# EasyEDA Pro project Timer_PCB_Project.eprj

# Schematic Schematic1
Board Name: Board1; Create Date: 2025-04-19; Page Name: Timer Schematic; Project Name: Timer_PCB_Project; Schematic Name: Schematic1; Update Date: 2025-04-19; Company: EasyEDA.com; Page Size: A4; Version: V1.0
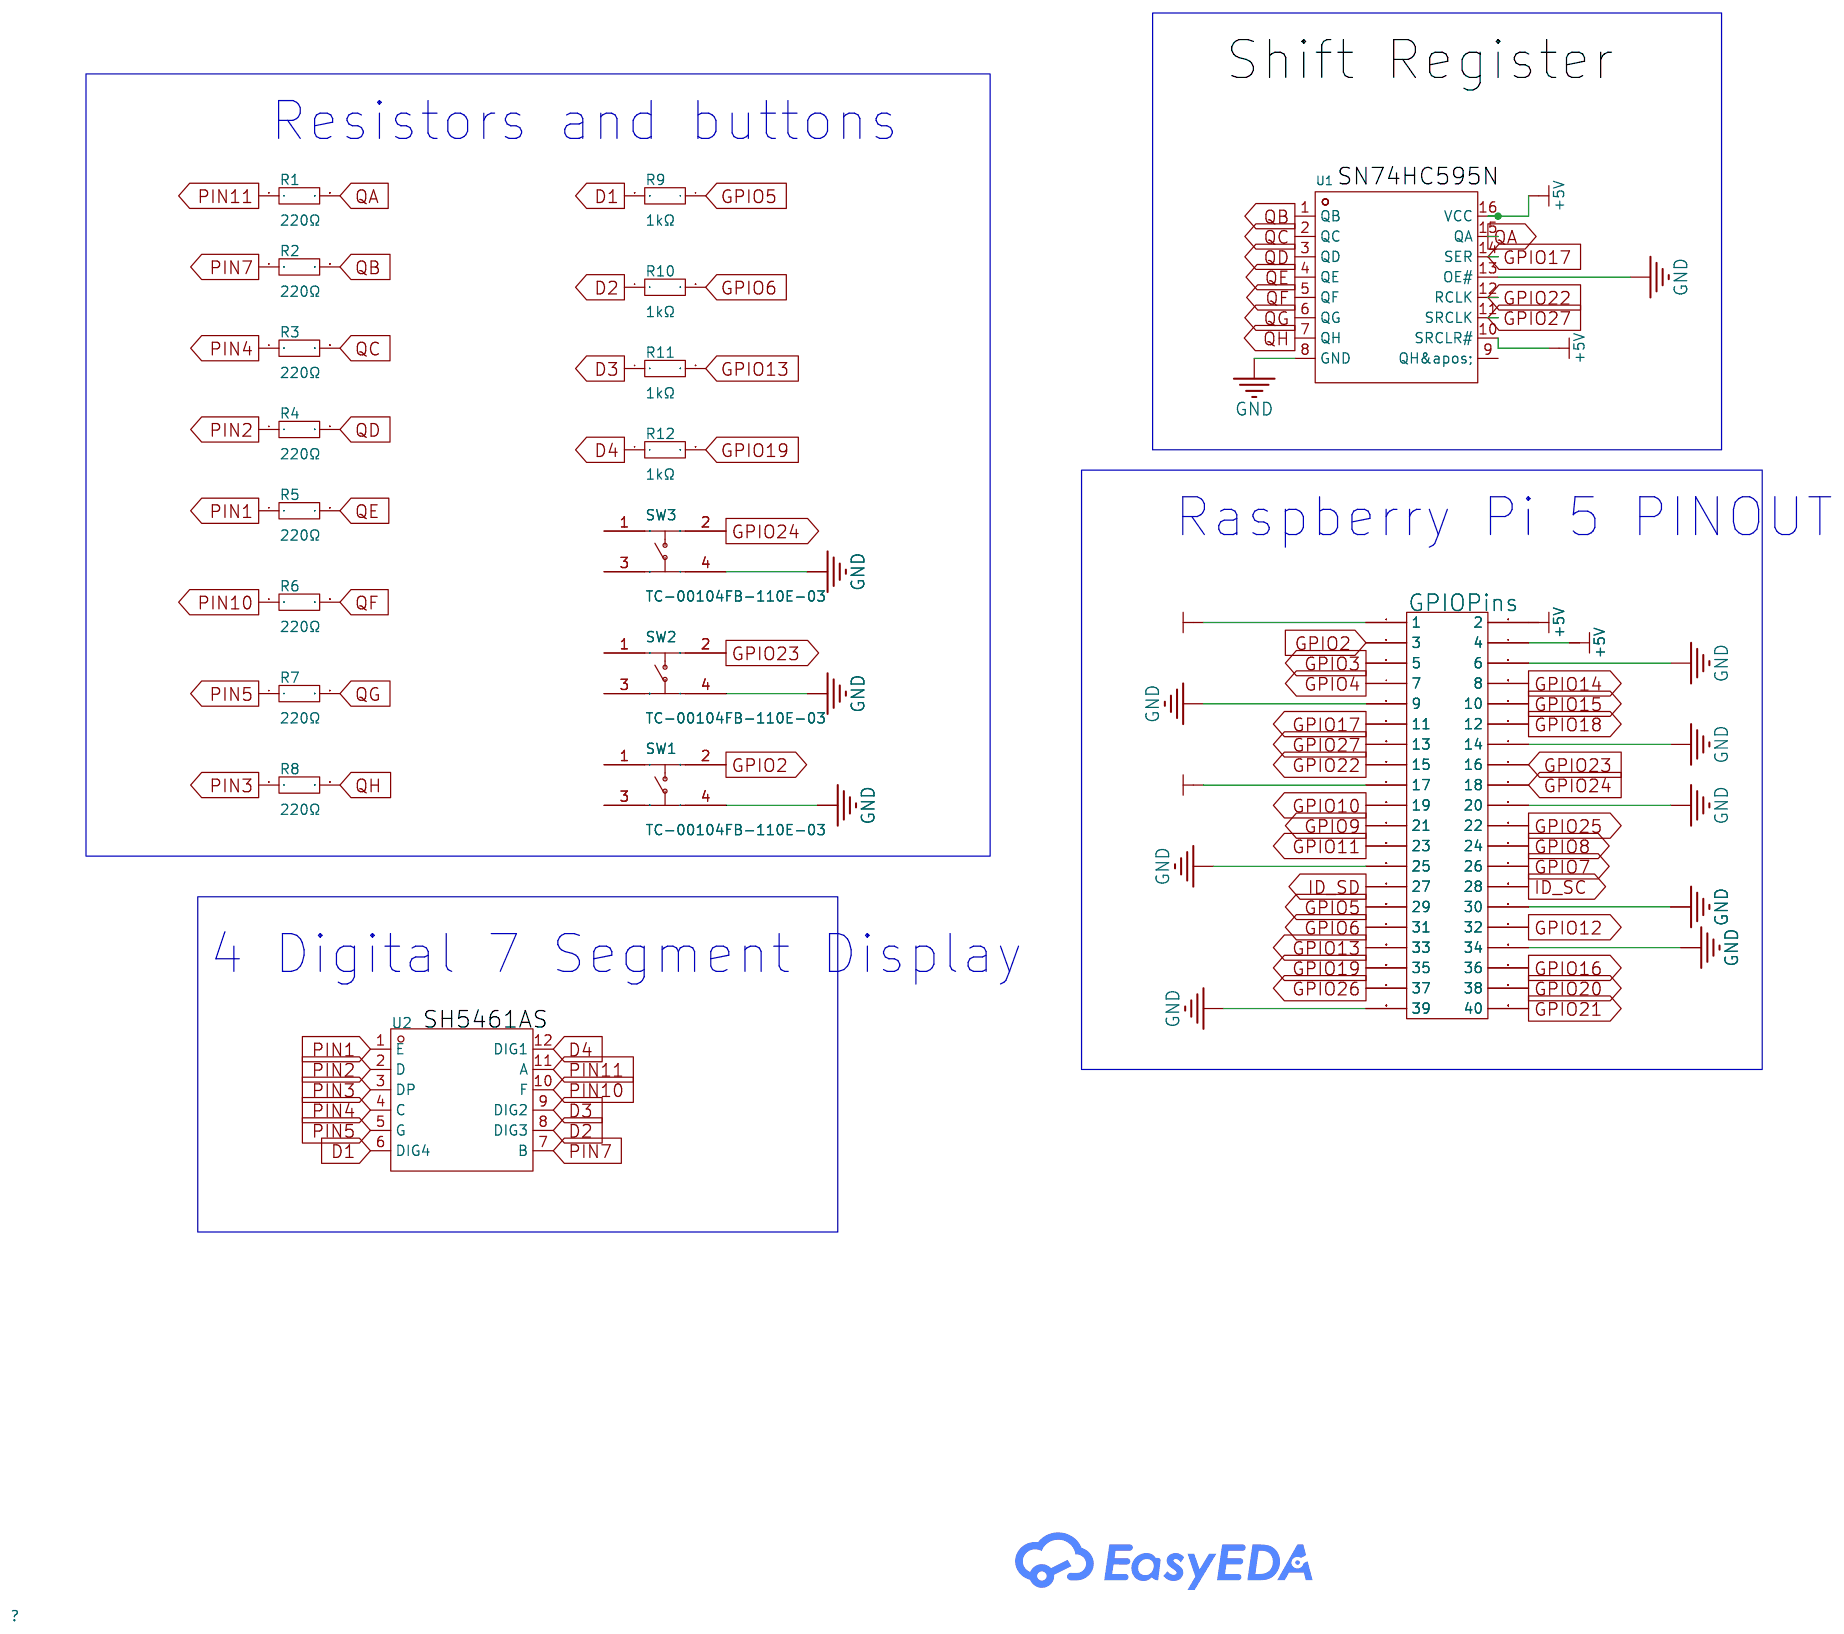
[diagram p0: schematic sheet]

## Parts
GPIOPins  2.54间距 双排弯针  [HDR-TH_20P-P2.54-H-R2-C10-S2.54-W12.0]
R1  220Ω  [RES-TH_BD1.8-L3.2-P7.20-D0.4]
R2  220Ω  [RES-TH_BD1.8-L3.2-P7.20-D0.4]
R3  220Ω  [RES-TH_BD1.8-L3.2-P7.20-D0.4]
R4  220Ω  [RES-TH_BD1.8-L3.2-P7.20-D0.4]
R5  220Ω  [RES-TH_BD1.8-L3.2-P7.20-D0.4]
R6  220Ω  [RES-TH_BD1.8-L3.2-P7.20-D0.4]
R7  220Ω  [RES-TH_BD1.8-L3.2-P7.20-D0.4]
R8  220Ω  [RES-TH_BD1.8-L3.2-P7.20-D0.4]
R9  1kΩ  [RES-TH_BD1.8-L3.2-P7.20-D0.4]
R10  1kΩ  [RES-TH_BD1.8-L3.2-P7.20-D0.4]
R11  1kΩ  [RES-TH_BD1.8-L3.2-P7.20-D0.4]
R12  1kΩ  [RES-TH_BD1.8-L3.2-P7.20-D0.4]
SW1  TC-00104FB-110E-03  [SW-TH_4P-L6.0-W6.0-P4.50-LS6.5]
SW2  TC-00104FB-110E-03  [SW-TH_4P-L6.0-W6.0-P4.50-LS6.5]
SW3  TC-00104FB-110E-03  [SW-TH_4P-L6.0-W6.0-P4.50-LS6.5]
U1  SN74HC595N  [DIP-16_L19.8-W6.5-P2.54-LS7.6-BL]
U2  SH5461AS  [LED-SEG-TH_12P-L24.0-W10.0-P2.54-S7.60]

## Library data of the parts
GPIOPins = 2.54间距 双排弯针: LCSC Part Name: 2.54mm 2*20P 弯 排针; Supplier Part: C42157; Supplier Footprint: 2x20P; JLCPCB Part Class: Extended Part; Supplier: LCSC
R1-R12 = Res_AXIAL-1/8W: Supplier Footprint: Through
SW1-SW3 = TC-00104FB-110E-03: Supplier Part: C7542981; Manufacturer: HOOYA(皓宇电子); Supplier Footprint: DIP; JLCPCB Part Class: Extended Part; Datasheet: https://atta.szlcsc.com/upload/public/pdf/source/20240226/4796A29EA251D564C3D729191F5C4338.pdf; Supplier: LCSC; Contact Current: 50mA; Voltage Rating (DC): 12V
U1 = SN74HC595N: LCSC Part Name: 三态输出 8位串行至串行或并行移位寄存器; Supplier Part: C78711; Manufacturer: TI(德州仪器); Supplier Footprint: DIP-16; JLCPCB Part Class: Extended Part; Datasheet: https://www.ti.com/cn/lit/gpn/sn74hc595; Supplier: LCSC; Function: 串行至串行或并行; Supply Voltage: 2V~6V; Number of Elements: 1; Number of Bits per Element: 8; Output Type: Tri-State; Operating Temperature: -40℃~+85℃
U2 = KYX-2453AS: Supplier Part: C9900040031; Supplier Footprint: LED-SEG-TH_12P-L24-W10.0-P2.54-BL; JLCPCB Part Class: Extended Part; Supplier: LCSC

## Nets
+3.3V: GPIOPins.1 GPIOPins.17
+5V: GPIOPins.2 GPIOPins.4 U1.10(SRCLR#) U1.16(VCC)
GND: GPIOPins.6 GPIOPins.9 GPIOPins.14 GPIOPins.20 GPIOPins.25 GPIOPins.30 GPIOPins.34 GPIOPins.39 SW1.4 SW2.4 SW3.4 U1.8(GND) U1.13(OE#)
D1: R9.2 U2.6(DIG4)
D2: R10.1 U2.8(DIG3)
D3: R11.1 U2.9(DIG2)
D4: R12.1 U2.12(DIG1)
GPIO2: GPIOPins.3 SW1.2
GPIO3: GPIOPins.5
GPIO4: GPIOPins.7
GPIO5: GPIOPins.29 R9.1
GPIO6: GPIOPins.31 R10.2
GPIO7: GPIOPins.26
GPIO8: GPIOPins.24
GPIO9: GPIOPins.21
GPIO10: GPIOPins.19
GPIO11: GPIOPins.23
GPIO12: GPIOPins.32
GPIO13: GPIOPins.33 R11.2
GPIO14: GPIOPins.8
GPIO15: GPIOPins.10
GPIO16: GPIOPins.36
GPIO17: GPIOPins.11 U1.14(SER)
GPIO18: GPIOPins.12
GPIO19: GPIOPins.35 R12.2
GPIO20: GPIOPins.38
GPIO21: GPIOPins.40
GPIO22: GPIOPins.15 U1.12(RCLK)
GPIO23: GPIOPins.16 SW2.2
GPIO24: GPIOPins.18 SW3.2
GPIO25: GPIOPins.22
GPIO26: GPIOPins.37
GPIO27: GPIOPins.13 U1.11(SRCLK)
ID_SC: GPIOPins.28
ID_SD: GPIOPins.27
PIN1: R5.1 U2.1(E)
PIN2: R4.1 U2.2(D)
PIN3: R8.1 U2.3(DP)
PIN4: R3.1 U2.4(C)
PIN5: R7.1 U2.5(G)
PIN7: R2.1 U2.7(B)
PIN10: R6.1 U2.10(F)
PIN11: R1.1 U2.11(A)
QA: R1.2 U1.15(QA)
QB: R2.2 U1.1(QB)
QC: R3.2 U1.2(QC)
QD: R4.2 U1.3(QD)
QE: R5.2 U1.4(QE)
QF: R6.2 U1.5(QF)
QG: R7.2 U1.6(QG)
QH: R8.2 U1.7(QH)

Not connected (* = marked no-connect by the designer): SW1 1 3; SW2 1 3; SW3 1 3; U1 9(QH&apos;)

## Notes on the sheet
- Shift Register
- Resistors and buttons
- Raspberry Pi 5 PINOUT
- 4 Digital 7 Segment Display

# Board Timer PCB
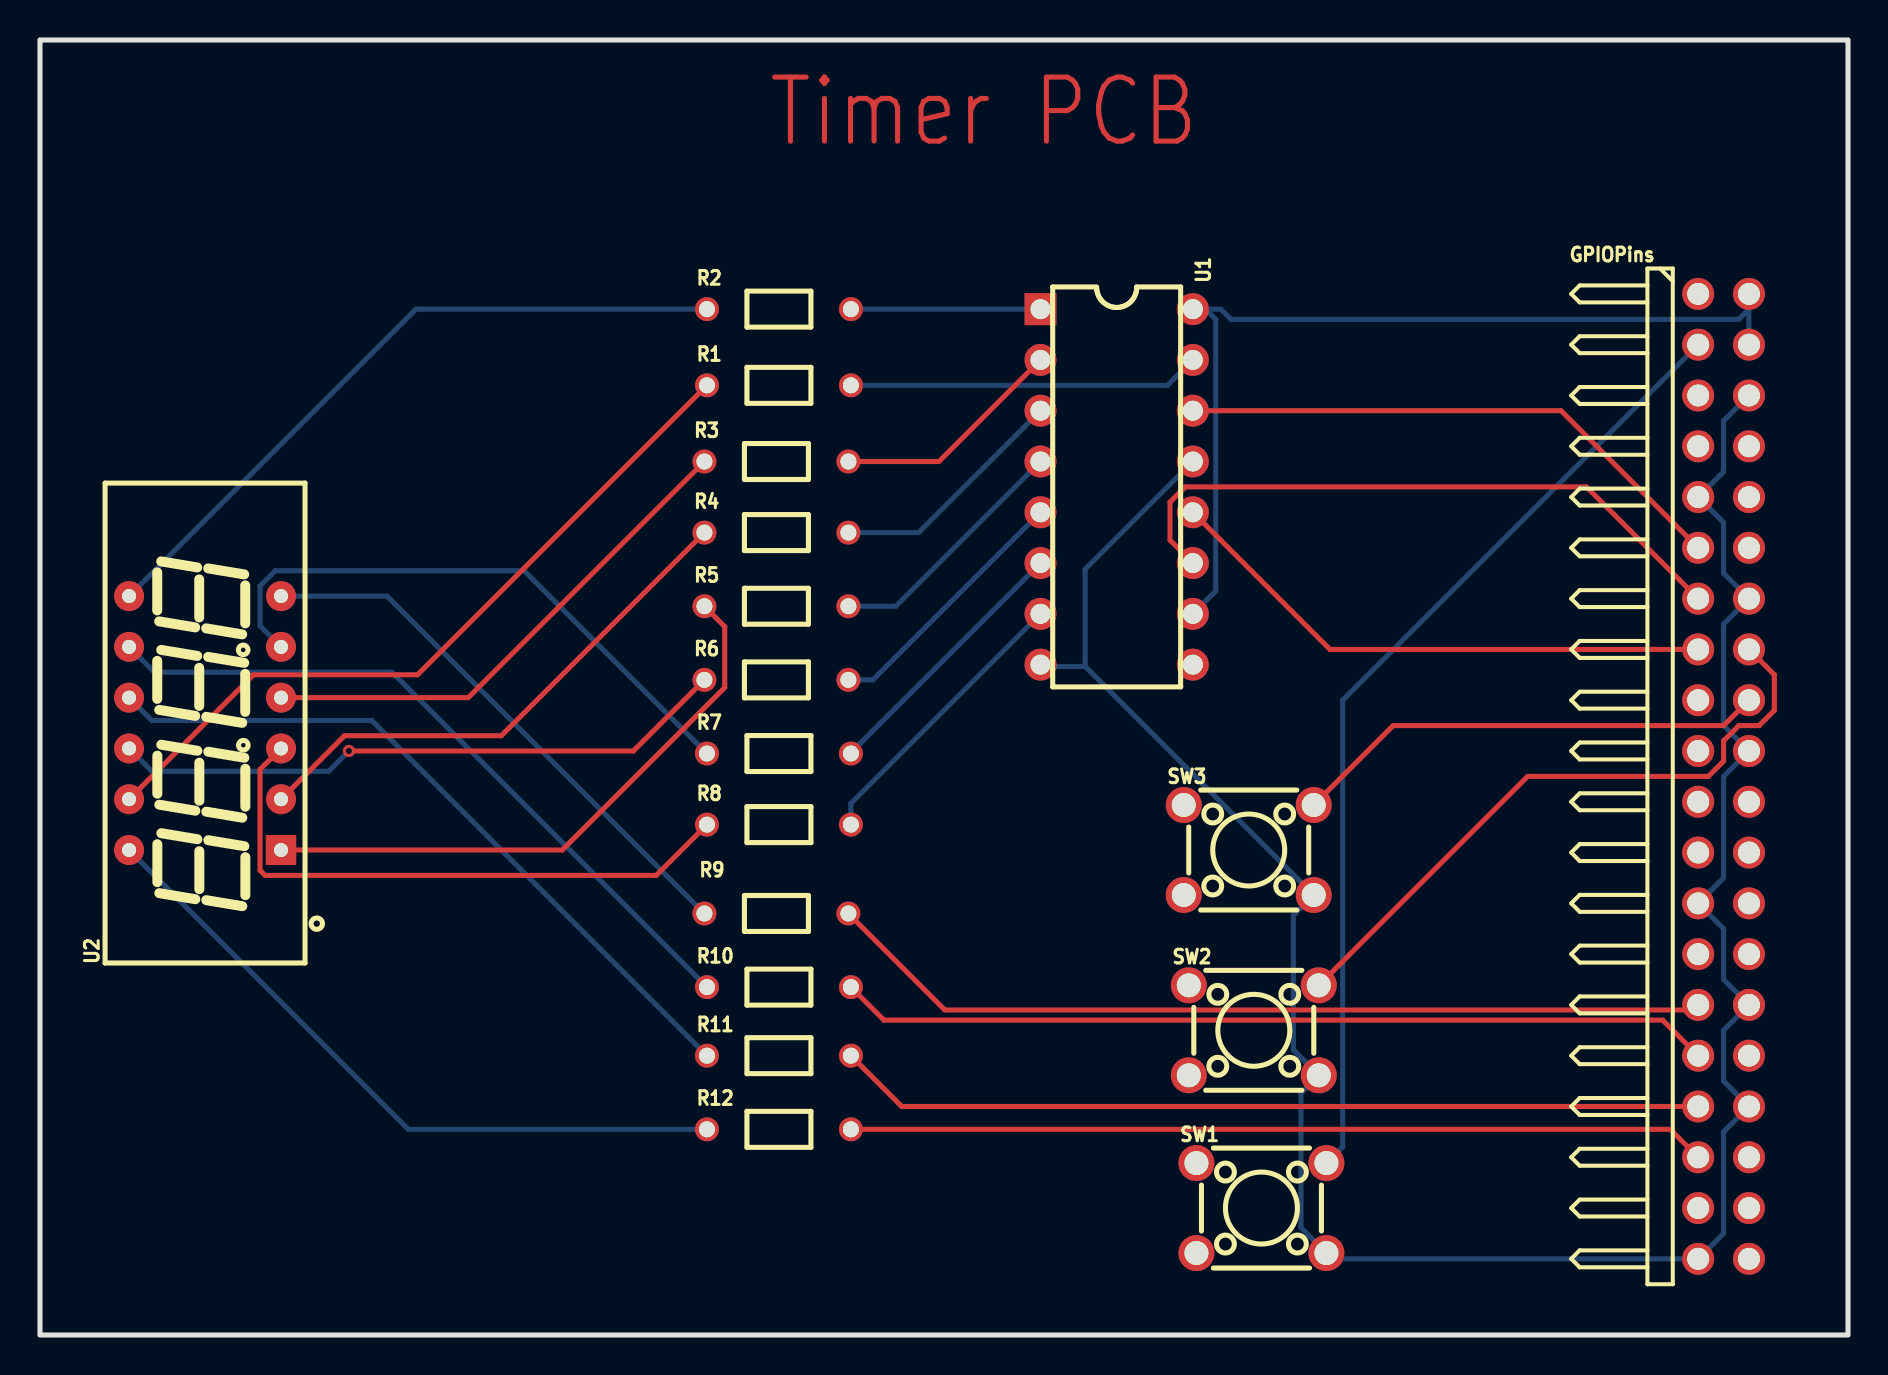
[diagram p1: board, top side]
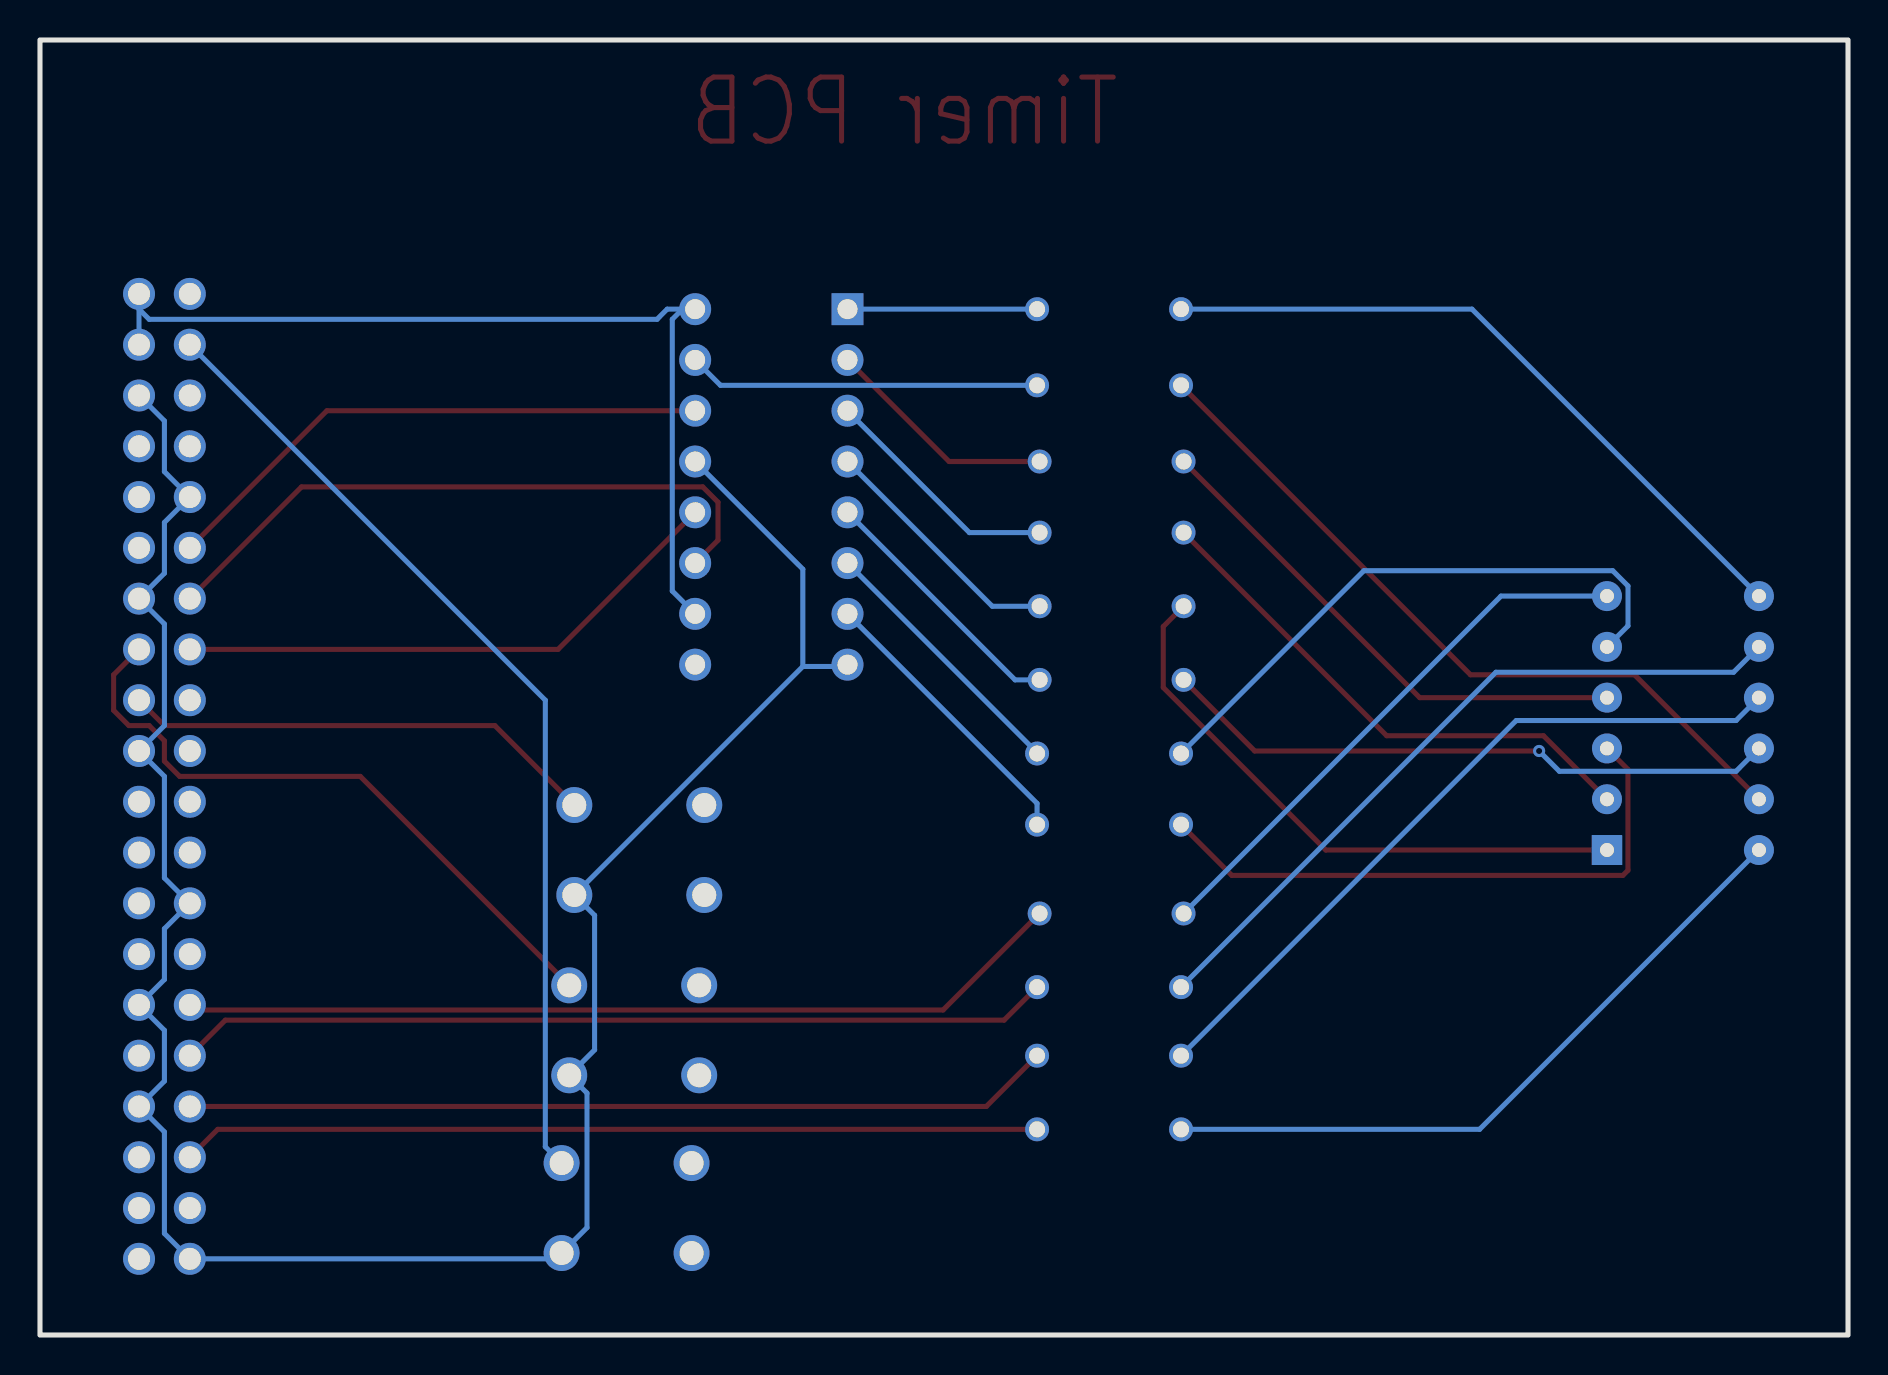
[diagram p2: board, bottom side, seen from below]

Outline 90.42 x 64.77 mm; copper layers: Top Layer, Bottom Layer. Coordinates in mm from the lower left corner of the outline.
Outline path: rectangle 0,64.77 90.42,0
Stack: Top Layer 0.035mm / Dielectric1 1.51mm FR4 er 4.5 / Bottom Layer 0.035mm

## Design rules (mm)
template: JLCPCB Capability(Two Layers Board)
spacing copperThickness1oz (default): track to track 0.102, other pairs 0.152 to 0.3
spacing copperThickness2oz: track to track 0.203, other pairs 0.152 to 0.3
track width copperThickness1oz (default): min 0.127, default 0.254, max 2.54
track width copperThickness2oz: min 0.203, default 0.254, max 2.54
differential pair differentialPair (default): width min 0.127, default 0.254, max 2.54; gap min 0.152, default 0.152
via viaSize (default): diameter min 0.5, default 0.61, max 10; hole min 0.3, default 0.305, max 6.3

## Placement (name value [footprint] x y rotation side)
GPIOPins  2.54间距 双排弯针  [HDR-TH_20P-P2.54-H-R2-C10-S2.54-W12.0]  84.2 27.94 0 top
R1  220Ω  [RES-TH_BD1.8-L3.2-P7.20-D0.4]  36.96 47.5 0 top
R2  220Ω  [RES-TH_BD1.8-L3.2-P7.20-D0.4]  36.96 51.31 0 top
R3  220Ω  [RES-TH_BD1.8-L3.2-P7.20-D0.4]  36.83 43.69 0 top
R4  220Ω  [RES-TH_BD1.8-L3.2-P7.20-D0.4]  36.83 40.13 0 top
R5  220Ω  [RES-TH_BD1.8-L3.2-P7.20-D0.4]  36.83 36.45 0 top
R6  220Ω  [RES-TH_BD1.8-L3.2-P7.20-D0.4]  36.83 32.77 0 top
R7  220Ω  [RES-TH_BD1.8-L3.2-P7.20-D0.4]  36.96 29.08 0 top
R8  220Ω  [RES-TH_BD1.8-L3.2-P7.20-D0.4]  36.96 25.53 0 top
R9  1kΩ  [RES-TH_BD1.8-L3.2-P7.20-D0.4]  36.83 21.08 180 top
R10  1kΩ  [RES-TH_BD1.8-L3.2-P7.20-D0.4]  36.96 17.4 0 top
R11  1kΩ  [RES-TH_BD1.8-L3.2-P7.20-D0.4]  36.96 13.97 0 top
R12  1kΩ  [RES-TH_BD1.8-L3.2-P7.20-D0.4]  36.96 10.29 0 top
SW1  TC-00104FB-110E-03  [SW-TH_4P-L6.0-W6.0-P4.50-LS6.5]  61.09 6.35 0 top
SW2  TC-00104FB-110E-03  [SW-TH_4P-L6.0-W6.0-P4.50-LS6.5]  60.71 15.24 0 top
SW3  TC-00104FB-110E-03  [SW-TH_4P-L6.0-W6.0-P4.50-LS6.5]  60.45 24.26 0 top
U1  SN74HC595N  [DIP-16_L19.8-W6.5-P2.54-LS7.6-BL]  53.85 42.42 270 top
U2  SH5461AS  [LED-SEG-TH_12P-L24.0-W10.0-P2.54-S7.60]  8.26 30.61 90 top

## Footprints (pads in the part's own frame, mm; a bottom-side part is the same pattern mirrored in y, then rotated)
DIP-16_L19.8-W6.5-P2.54-LS7.6-BL
  rect 1.6x1.6 hole 1: 1(-8.89,-3.81)
  round 1.6 hole 1: 2(-6.35,-3.81) 3(-3.81,-3.81) 4(-1.27,-3.81) 5(1.27,-3.81) 6(3.81,-3.81) 7(6.35,-3.81) 8(8.89,-3.81) 9(8.89,3.81) 10(6.35,3.81) 11(3.81,3.81) 12(1.27,3.81) 13(-1.27,3.81) 14(-3.81,3.81) 15(-6.35,3.81) 16(-8.89,3.81)
HDR-TH_20P-P2.54-H-R2-C10-S2.54-W12.0
  round 1.6 hole 1.1: 1(-1.27,24.13) 2(1.27,24.13) 3(-1.27,21.59) 4(1.27,21.59) 5(-1.27,19.05) 6(1.27,19.05) 7(-1.27,16.51) 8(1.27,16.51) 9(-1.27,13.97) 10(1.27,13.97) 11(-1.27,11.43) 12(1.27,11.43) 13(-1.27,8.89) 14(1.27,8.89) 15(-1.27,6.35) 16(1.27,6.35) 17(-1.27,3.81) 18(1.27,3.81) 19(-1.27,1.27) 20(1.27,1.27) 21(-1.27,-1.27) 22(1.27,-1.27) 23(-1.27,-3.81) 24(1.27,-3.81) 25(-1.27,-6.35) 26(1.27,-6.35) 27(-1.27,-8.89) 28(1.27,-8.89) 29(-1.27,-11.43) 30(1.27,-11.43) 31(-1.27,-13.97) 32(1.27,-13.97) 33(-1.27,-16.51) 34(1.27,-16.51) 35(-1.27,-19.05) 36(1.27,-19.05) 37(-1.27,-21.59) 38(1.27,-21.59) 39(-1.27,-24.13) 40(1.27,-24.13)
LED-SEG-TH_12P-L24.0-W10.0-P2.54-S7.60
  rect 1.5x1.524 hole 0.7: 1(-6.35,-3.8)
  round 1.5 hole 0.7: 2(-3.81,-3.8) 3(-1.27,-3.8) 4(1.27,-3.8) 5(3.81,-3.8) 6(6.35,-3.8) 7(6.35,3.8) 8(3.81,3.8) 9(1.27,3.8) 10(-1.27,3.8) 11(-3.81,3.8) 12(-6.35,3.8)
RES-TH_BD1.8-L3.2-P7.20-D0.4
  round 1.2 hole 0.8: 1(-3.6,0) 2(3.6,0)
SW-TH_4P-L6.0-W6.0-P4.50-LS6.5
  round 1.8 hole 1.2: 1(-3.25,2.25) 2(3.25,2.25) 3(-3.25,-2.25) 4(3.25,-2.25)

## Nets
As in the schematic.

Pads without a net: SW1 1 3; SW2 1 3; SW3 1 3; U1 9

## Via types
v1: diameter 0.61, hole 0.305, Top Layer to Bottom Layer, 1 via

## Routing (per net, layer and track width the routed paths; a pad name or vN(x,y) marks a point on that pad's centre or on a via; arc(x,y) is an arc through that point)
+5V: length 46.7
  Bottom Layer w0.254: 58.29,51.31 58.8,50.8 58.8,37.21 U1.10 ; 58.29,51.31 U1.16 ; 58.29,51.31 59.06,51.31 59.56,50.8 84.96,50.8 85.47,51.31 ; 85.47,51.31 GPIOPins.2 ; 85.47,51.31 GPIOPins.4
GND: length 119.9
  Bottom Layer w0.254: 52.27,33.44 50.13,33.44 U1.8 ; 52.27,33.44 52.27,38.3 U1.13 ; 52.27,33.44 SW3.4 62.69,20.99 62.69,14.26 SW2.4 63.07,12.1 63.07,5.37 SW1.4 64.63,3.81 82.93,3.81 84.2,5.08 84.2,10.16 GPIOPins.34 84.2,12.7 84.2,15.24 GPIOPins.30 84.2,17.78 84.2,20.32 82.93,21.59 84.2,22.86 84.2,27.94 GPIOPins.20 84.2,30.48 84.2,35.56 GPIOPins.14 84.2,38.1 84.2,40.64 82.93,41.91 84.2,43.18 84.2,45.72 GPIOPins.6
D1: length 27.8
  Bottom Layer w0.254: U2.6 17.36,36.96 R9.2
D2: length 36
  Bottom Layer w0.254: R10.1 17.61,33.15 5.73,33.15 U2.8
D3: length 36.3
  Bottom Layer w0.254: U2.9 5.6,30.73 16.59,30.73 R11.1
D4: length 34.7
  Bottom Layer w0.254: R12.1 18.43,10.29 U2.12
GPIO2: length 48.6
  Bottom Layer w0.254: 82.93,49.53 65.15,31.75 65.15,9.41 SW1.2
GPIO5: length 44.6
  Top Layer w0.254: 82.93,16.51 82.68,16.26 45.26,16.26 R9.1
GPIO6: length 43.8
  Top Layer w0.254: R10.2 42.21,15.75 81.15,15.75 82.93,13.97
GPIO13: length 43.4
  Top Layer w0.254: 82.93,11.43 43.1,11.43 R11.2
GPIO17: length 28.1
  Top Layer w0.254: 82.93,39.37 76.07,46.23 U1.14
GPIO19: length 43
  Top Layer w0.254: 82.93,8.89 81.53,10.29 R12.2
GPIO22: length 28.1
  Top Layer w0.254: U1.12 64.52,34.29 82.93,34.29
GPIO23: length 32.7
  Top Layer w0.254: SW2.2 74.41,27.94 83.44,27.94 84.2,28.7 84.2,29.72 84.96,30.48 85.98,30.48 86.74,31.24 86.74,33.02 GPIOPins.16
GPIO24: length 23.9
  Top Layer w0.254: SW3.2 67.68,30.48 84.2,30.48 GPIOPins.18
GPIO27: length 32.6
  Top Layer w0.254: 82.93,36.83 77.34,42.42 57.28,42.42 56.52,41.66 56.52,39.75 U1.11
PIN1: length 30
  Top Layer w0.254: U2.1 26.12,24.26 34.25,32.38 34.25,35.43 R5.1
PIN2: length 26.7
  Top Layer w0.254: R4.1 23.07,29.97 15.23,29.97 U2.2
PIN3: length 30
  Top Layer w0.254: U2.3 11.01,28.29 11.01,23.24 11.26,22.99 30.82,22.99 R8.1
PIN4: length 26.1
  Top Layer w0.254: R3.1 21.42,31.88 U2.4
PIN5: length 29.9
  Bottom Layer w0.254: R7.1 24.21,38.23 11.77,38.23 11.01,37.46 11.01,35.47 U2.5
PIN7: length 34.8
  Bottom Layer w0.254: R2.1 18.81,51.31 U2.7
PIN10: length 31.1
  Top Layer w0.254: v1(15.45,29.21) 29.67,29.21 R6.1
  Bottom Layer w0.254: U2.10 5.6,28.19 14.43,28.19 v1(15.45,29.21)
PIN11: length 37.5
  Top Layer w0.254: R1.1 18.88,33.02 10.68,33.02 U2.11
QA: length 17.6
  Bottom Layer w0.254: R1.2 56.39,47.5 U1.15
QB: length 9.5
  Bottom Layer w0.254: R2.2 U1.1
QC: length 11.7
  Top Layer w0.254: R3.2 44.96,43.69 U1.2
QD: length 12.1
  Bottom Layer w0.254: R4.2 43.94,40.13 U1.3
QE: length 12.6
  Bottom Layer w0.254: U1.4 42.8,36.45 R5.2
QF: length 13.1
  Bottom Layer w0.254: U1.5 41.66,32.77 R6.2
QG: length 13.5
  Bottom Layer w0.254: R7.2 40.56,29.13 U1.6
QH: length 14.5
  Bottom Layer w0.254: U1.7 40.56,26.59 R8.2

## Text on the board
Top Layer: Timer PCB
